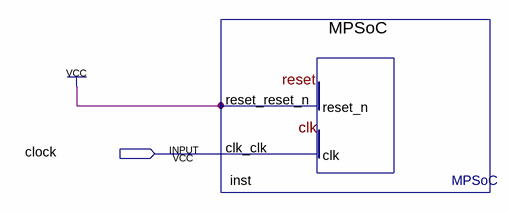
[diagram p0: schematic sheet]
// Quartus schematic TopLevel.bdf as structural Verilog: 1 symbols, 1 pins
module TopLevel (
  input  clock
);

  MPSoC inst (.reset_reset_n(1'b1), .clk_clk(clock));
endmodule
